# Altium schematic sheet Connectors.SchDoc
size A; SheetNumber: 4; SheetTotal: 6
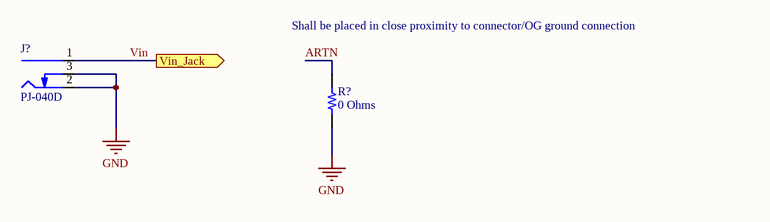
[diagram p0: Connectors.SchDoc]

## Parts
J?  PJ-040D  [CUI PJ-040D]
R?  0 Ohms  [RES 0805_2012]

## Ports
Vin_Jack (out)

## Nets
GND: J?.2(Outer) J?.3(SW) R?.1
ARTN: R?.2
Vin: J?.1(Centre) ; port Vin_Jack

## Notes on the sheet
- Shall be placed in close proximity to connector/OG ground connection

## Library data of the parts
J? = PJ-040D: CONN PWR JACK 1.3X3.4MM SOLDER; Manufacturer: CUI Devices; Actual Diameter: 0.051" (1.30mm ID), 0.150" (3.80mm OD); Current Rating (Amps): 2A; Gender: Male; Industry Recognized Mating Diameter: 1.30mm ID (0.051"), 3.50mm OD (0.138"); Internal Switch(s): Single Switch, Normally Closed; Material Flammability Rating: UL94 V-0; Mating Length/Depth: 0.339" (8.60mm); Number of Positions/Contacts: 2 Conductors, 3 Contacts; Shielding: Unshielded; Voltage - Rated: 24VDC; Part Number: PJ-040D; ComponentLink1Description: Datasheet; ComponentLink1URL: https://www.cuidevices.com/product/resource/digikeypdf/pj-040d.pdf; ComponentLink2Description: DigiKey Link; ComponentLink2URL: //digikey.com/product-detail/en/cui-devices/PJ-040D/CP-040D-ND/1644558; Connector Type: Jack; Features: Board Guide; LastUpdated: 12/16/2019 6:56:22 PM; Lifecycle Status: 0; Minimum Order: 1; Mounting Type: Through Hole, Right Angle; Packaging: Bulk; Part Status: Active; Price: 0.63; Series: -; Supplier 1: DigiKey; Supplier Part Number 1: CP-040D-ND; Termination: Solder
R? = CRCW08050000Z0ECC: RES 0 OHM JUMPER 1/8W 0805; Manufacturer: Vishay Dale; Power (Watts): 0.125W, 1/8W; Part Number: CRCW08050000Z0ECC; Value: 0 Ohms; ComponentLink1Description: Datasheet; ComponentLink1URL: http://www.vishay.com/docs/28773/crcwce3.pdf; ComponentLink2Description: DigiKey Link; ComponentLink2URL: https://www.digikey.com/en/products/detail/vishay-dale/CRCW08050000Z0ECC/7928549; Composition: Thick Film; Device Package: 0805 (2012 Metric); Height - Seated (Max): 0.024" (0.60mm); LastUpdated: 8/22/2023 7:47:38 PM; Lifecycle Status: Active; Minimum Order: 1; Number of Terminations: 2; Operating Temperature: -55°C ~ 155°C; Package / Case: 0805 (2012 Metric); Packaging: CutTape; PartId: 41979; Part Status: Active; Price: 0.01; Resistance: 0 Ohms; Series: CRCW-C; Size / Dimension: 0.079" L x 0.049" W (2.00mm x 1.25mm); Supplier 1: DigiKey; Supplier Part Number 1: 541-4127-1-ND; Supplier Device Package: 0805; Tolerance: Jumper